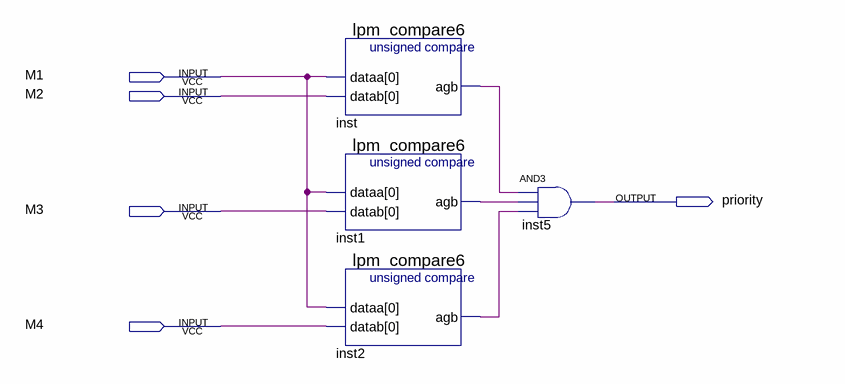
[diagram p0: schematic sheet]
// Quartus schematic Priority.bdf as structural Verilog: 4 symbols, 5 pins
module Priority (
  input  M1,
  input  M2,
  input  M3,
  input  M4,
  output \priority 
);

  wire inst1_agb, inst2_agb, inst_agb;

  lpm_compare6 inst (.dataa(M1), .datab(M2), .agb(inst_agb));
  lpm_compare6 inst1 (.dataa(M1), .datab(M3), .agb(inst1_agb));
  lpm_compare6 inst2 (.dataa(M1), .datab(M4), .agb(inst2_agb));
  and inst5 (\priority , inst_agb, inst1_agb, inst2_agb);
endmodule
